# Altium schematic sheet PS_Board_p1.SchDoc: Блок питания модуля управления
size A4; Revision: Rev. A
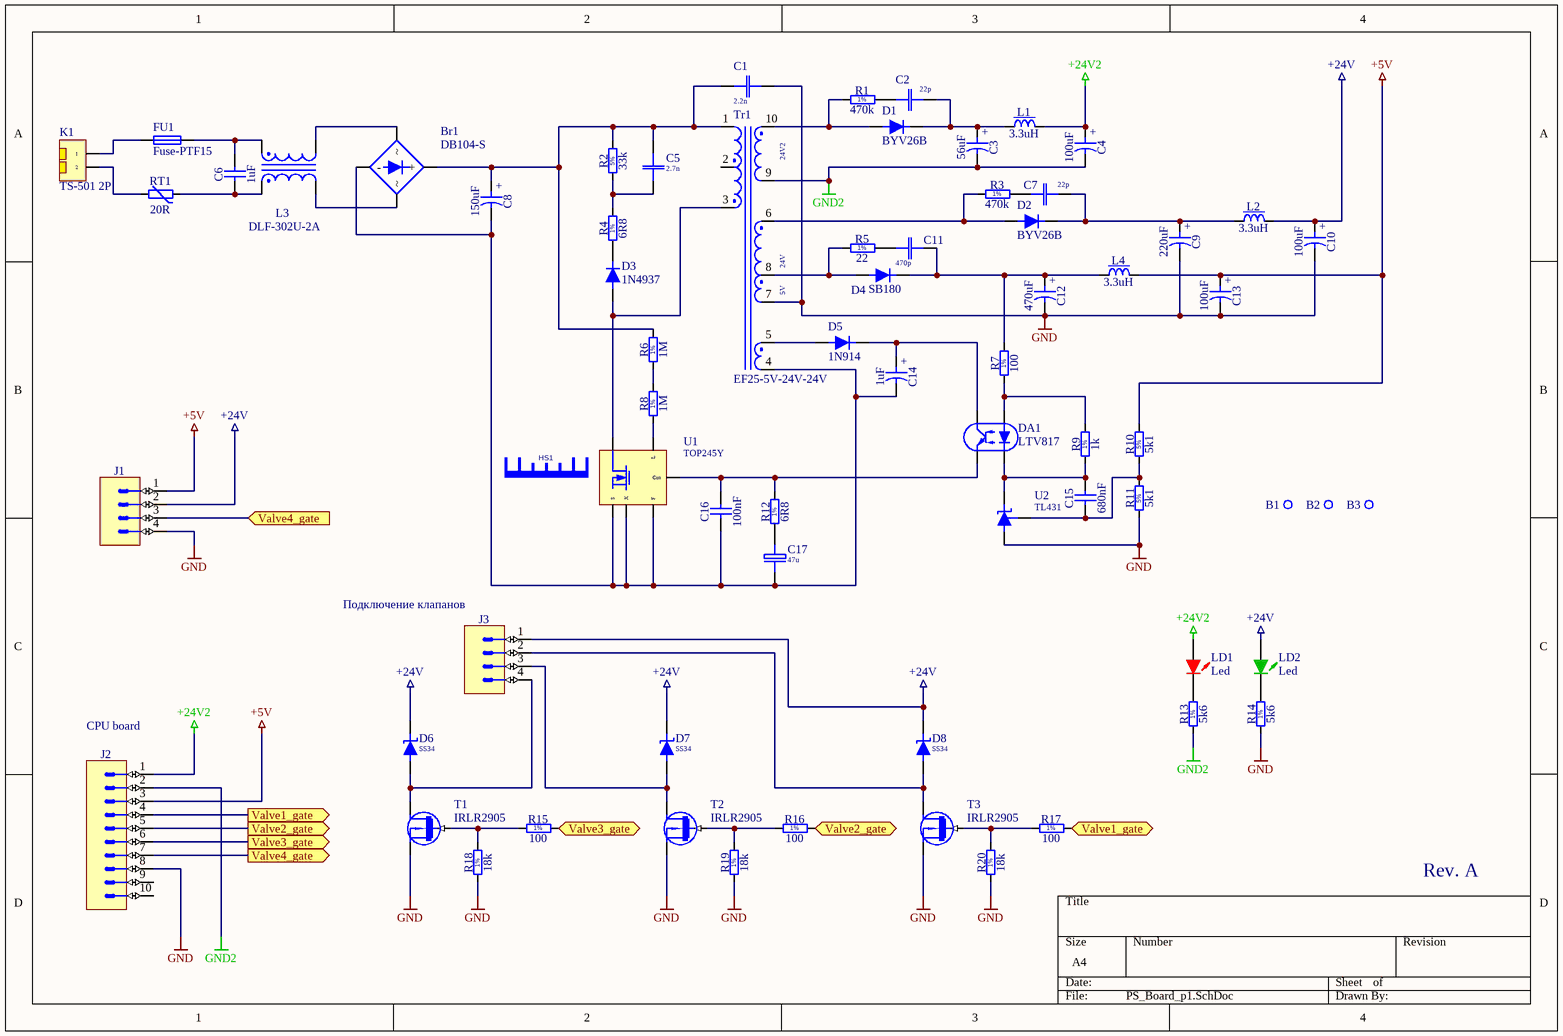
[diagram p0: PS_Board_p1.SchDoc]

## Parts
B1  Plated Hole  [MTG350_650]  (value not drawn)
B2  Plated Hole  [MTG350_650]  (value not drawn)
B3  Plated Hole  [MTG350_650]  (value not drawn)
Br1  DB104-S  [DB-S]
C1  2.2n  [C Y2 7.5b]
C2  22p  [Cap-Disk-D5.5-R5.08]
C3  56uF  [CAPPR500-1050X1150]
C4  100uF  [CAPPR350-850X800]
C5  2.7n  [C Y2 7.5b]
C6  1uF  [CAPR2750-1300X3150X2400]
C7  22p  [Cap-Disk-D5.5-R5.08]
C8  150uF  [CAPPR1000-2300X4200]
C9  220uF  [CAPPR350-850X1300]
C10  100uF  [CAPPR350-850X800]
C11  470p  [Cap-Disk-D5.5-R5.08]
C12  470uF  [CAPPR500-1050X2200]
C13  100uF  [CAPPR350-850X800]
C14  1uF  [CAPPRB254-450X710]
C15  680nF  [CAPC2012X135N]
C16  100nF  [CAPC2012X135N]
C17  47u  [El-d5-h11-F2.54]
D1  BYV26B  [SOD-64-300]
D2  BYV26B  [SOD-64-300]
D3  1N4937  [DO-41-300]
D4  SB180  [DO-41-300]
D5  1N914  [DO-35-300]
D6  SS34  [DO-214AB (SMC)]
D7  SS34  [DO-214AB (SMC)]
D8  SS34  [DO-214AB (SMC)]
DA1  LTV817  [DIL4-300a]
FU1  Fuse-PTF15  [FUSE-MCH]
HS1  Heat Sink No Pad  [HSINK_FISCHER_FK 242 SA 220 O_V]  (value not drawn)
J1  KK®  [MOLEX_22-27-2041]  (value not drawn)
J2  C-Grid®  [MOLEX_70246-1004]  (value not drawn)
J3  KK®  [MOLEX_22-27-2041]  (value not drawn)
K1  TS-501 2P  [TS-501 2P-2.5]
L1  3.3uH  [IND_WURTH_WE-TI]
L2  3.3uH  [IND_WURTH_WE-TI]
L3  DLF-302U-2A  [DLF-302U-2A]
L4  3.3uH  [IND_WURTH_WE-TI]
LD1  Led  [Led 0805-Red]
LD2  Led  [Led 0805-Green]
R1  470k  [RES1016-630X250]
R2  33k  [RES2286-1670X520]
R3  470k  [RES1016-630X250]
R4  6R8  [RES1016-630X250]
R5  22  [RES1016-630X250]
R6  1M  [RES1016-630X250]
R7  100  [RES1016-630X250]
R8  1M  [RES1016-630X250]
R9  1k  [RES1016-630X250]
R10  5k1  [RES_ARCOL_RCC025]
R11  5k1  [RES_ARCOL_RCC025]
R12  6R8  [RES1016-630X250]
R13  5k6  [RESC2012X60N]
R14  5k6  [RESC2012X60N]
R15  100  [RESC2012X60N]
R16  100  [RESC2012X60N]
R17  100  [RESC2012X60N]
R18  18k  [RESC2012X60N]
R19  18k  [RESC2012X60N]
R20  18k  [RESC2012X60N]
RT1  20R  [THERM_EPCOS_B57153S0]
T1  IRLR2905  [TO252AA]
T2  IRLR2905  [TO252AA]
T3  IRLR2905  [TO252AA]
Tr1  EF25-5V-24V-24V  [SP-EF25]
U1  TOP245Y  [TO220-7C]
U2  TL431  [TO92C]

## Ports
Valve1_gate (in), Valve1_gate (out), Valve2_gate (in), Valve2_gate (out), Valve3_gate (in), Valve3_gate (out), Valve4_gate (in), Valve4_gate (out)

## Nets
+5V: C13.1 J1.1 J2.3 L4.2 R10.2
+24V: C10.1 D6.2(K) D7.2(K) D8.2(K) J1.2 J3.1 L2.2 LD2.1(A)
+24V2: C4.1 J2.1 L1.2 LD1.1(A)
GND: C1.2 C9.2 C10.2 C12.2 C13.2 J1.4 J2.8 R11.1 R14.1 R18.1 R19.1 R20.1 T1.3(S) T2.3(S) T3.3(S) Tr1.7 U2.2(A)
GND2: C3.2 C4.2 J2.2 R13.1 Tr1.9
Valve1_gate: J2.4 R17.2 ; port Valve1_gate
Valve2_gate: J2.5 R16.2 ; port Valve2_gate
Valve3_gate: J2.6 R15.2 ; port Valve3_gate
Valve4_gate: J1.3 J2.7 ; port Valve4_gate
NetBr1_1: Br1.1(+) C1.1 C5.2 C8.1 R2.2 R6.2 Tr1.1
NetBr1_2: Br1.2(-) C8.2 C14.2 C16.1 C17.2 Tr1.4 U1.3(X) U1.4(S) U1.5(F)
NetBr1_3: Br1.3 L3.3
NetBr1_4: Br1.4 L3.4
NetC2_1: C2.1 R1.2
NetC2_2: C2.2 C3.1 D1.2(K) L1.1
NetC5_1: C5.1 R2.1 R4.2
NetC6_1: C6.1 L3.2 RT1.2
NetC6_2: C6.2 FU1.1 L3.1
NetC7_1: C7.1 R3.2
NetC7_2: C7.2 C9.1 D2.2(K) L2.1
NetC11_1: C11.1 R5.2
NetC11_2: C11.2 C12.1 D4.2(K) L4.1 R7.2
NetC14_1: C14.1 D5.2(C) DA1.4(C)
NetC15_1: C15.1 R10.1 R11.2 U2.3(Adj)
NetC15_2: C15.2 DA1.2(C) R9.1 U2.1(K)
NetC16_2: C16.2 DA1.3(E) R12.2 U1.1(Con)
NetC17_1: C17.1 R12.1
NetD1_1: D1.1(A) R1.1 Tr1.10
NetD2_1: D2.1(A) R3.1 Tr1.6
NetD3_1: D3.1(A) Tr1.3 U1.7(D)
NetD3_2: D3.2(K) R4.1
NetD4_1: D4.1(A) R5.1 Tr1.8
NetD5_1: D5.1(A) Tr1.5
NetD6_1: D6.1(A) J3.4 T1.2(D)
NetD7_1: D7.1(A) J3.3 T2.2(D)
NetD8_1: D8.1(A) J3.2 T3.2(D)
NetDA1_1: DA1.1(A) R7.1 R9.2
NetFU1_2: FU1.2 K1.1
NetK1_2: K1.2 RT1.1
NetLD1_2: LD1.2(K) R13.2
NetLD2_2: LD2.2(K) R14.2
NetR6_1: R6.1 R8.2
NetR8_1: R8.1 U1.2(L)
NetR15_1: R15.1 R18.2 T1.1(G)
NetR16_1: R16.1 R19.2 T2.1(G)
NetR17_1: R17.1 R20.2 T3.1(G)

Not connected (* = marked no-connect by the designer): B1 1; B2 1; B3 1; J2 9 10; Tr1 2

## Notes on the sheet
- (near J3) Подключение клапанов
- (near J2) CPU board
- Rev. A
- (in symbol CAER_56UF_25V_20%_500-1050X1150_LESR0R025) +
- (in symbol CAER_100UF_25V_20%_RUBYCON_25ML100M8X7) +
- (in symbol CAER_150UF_400V_20%_EPCOS_B43501A9157M000) +
- (in symbol CAER_220UF_25V_20%_RUBYCON_25YXF220M8X11.5) +
- (in symbol CAER_470UF_25V_20%_500-1050X2200_LESR0R062) +
- (in symbol CTEB_1UF_35V_10%_254-450X710) +
- (in symbol EF25-5V-24V-24V) 24V2; 24V; 5V
- (in symbol R0805_5K6_1%_0.125W_100PPM) 1%
- (in symbol R0805_18K_1%_0.125W_100PPM) 1%
- (in symbol R0805_100R_1%_0.125W_100PPM) 1%
- (in symbol RCF_5K1_5%_0.25W_+10-6PPM_ARCOL_RCC025) 5%
- (in symbol RMF_1K_1%_0.6W_50PPM_1016-630X250) 1%
- (in symbol RMF_1M_1%_0.6W_50PPM_1016-630X250) 1%
- (in symbol RMF_6R8_1%_0.6W_50PPM_1016-630X250) 1%
- (in symbol RMF_22R_1%_0.6W_50PPM_1016-630X250) 1%
- (in symbol RMF_33K_5%_3W_250PPM_2286-1670X520) 5%
- (in symbol RMF_100R_1%_0.6W_50PPM_1016-630X250) 1%
- (in symbol RMF_470K_1%_0.6W_50PPM_1016-630X250) 1%

## Library data of the parts
B1-B3 = PLATED_HOLE3.5_PAD6.5: Single Terminal Socket; Part Description: Plated Through Hole: Hole Dia.=3.5mm Pad Dia.=6.5mm; Mounted: No; Table: Pads; Part Number: PLATED_HOLE3.5_PAD6.5; Component Kind: Standard (No BOM); Component Type: Standard (No BOM); Pin Count: 1; Family: Plated Hole; Socket: No; SMD: No; Status: None; ComponentHeight: 0mm; Author: CERN DEM JLC; CreateDate: 20.11.2008; LatestRevisionDate: 23.11.2011; PackageDescription: Plated Through Hole: Hole Dia.=3.5mm Pad Dia.=6.5mm
Br1 = DB104-S: SMD 1A 400V; Price: 0.23
C1 C5 = Y2 1n 250V AC: Y2 250V AC Y5P; Tip: Ceramic  Disc Y2 1nF 250VAC Y5P; Price: 0.1
  C1: Value: 2.2n
  C5: Value: 2.7n
C2 C7 = Cer Disc HV 220p 1kV: 22p 1kV Y5P; Tip: Suntan TS16 220pF 1kV Y5P; Price: 0.072; Value: 22p
C3 = CAER_56UF_25V_20%_500-1050X1150_LESR0R025: Polarised capacitor; Part Description: Low ESR 0R025 Aluminum Solid Capacitor With Organic Semiconductive Electrolyte; Manufacturer: SANYO OS-CON; Manufacturer Part Number: 25SP56M; Voltage: 25V; Tolerance: ±20%; Table: Capacitors THD; Part Number: CAER_56UF_25V_20%_500-1050X1150_LESR0R025; Component Kind: Standard; Component Type: Standard; Pin Count: 2; Value: 56uF; Status: Preferred; Case: LS5 D10.5 x H11.5; Mounted: Yes; Socket: No; SMD: No; ComponentHeight: 11.5mm; HelpURL: \\cern.ch\dfs\Applications\Altium\Datasheets\CAER-LESR_SANYO_SP.pdf; Author: CERN DEM JLC; CreateDate: 29.01.2008; LatestRevisionDate: 16.03.2009
C4 C10 C13 = CAER_100UF_25V_20%_RUBYCON_25ML100M8X7: Polarised capacitor; Part Description: Aluminum Electrolytic Capacitor, (ML Series); Voltage: 25V; Tolerance: ±20%; Table: Capacitors THD; Part Number: CAER_100UF_25V_20%_RUBYCON_25ML100M8X7; Component Kind: Standard; Component Type: Standard; Pin Count: 2; Value: 100uF; Status: None; Manufacturer: RUBYCON; Manufacturer Part Number: 25ML100M8X7; Case: LS3.5 D8.5 x H8; Mounted: Yes; Socket: No; SMD: No; ComponentHeight: 8mm; HelpURL: \\cern.ch\dfs\Applications\Altium\Datasheets\CAER_RUBYCON_25ML100M8X7.pdf; Author: CERN DEM JMW; CreateDate: 17.11.2008; LatestRevisionDate: 08.05.2013
C6 = CPPR_1UF_275VAC_20%_2750-1300X3150X2400: Non-polarised capacitor; Part Description: Metallized Polypropylene RFI Capacitor Class X2 (MKP-X2); Manufacturer: WIMA; Manufacturer Part Number: MKX21W41006D00MSSD; Voltage: 275VAC; Tolerance: ±20%; Table: Capacitors THD; Part Number: CPPR_1UF_275VAC_20%_2750-1300X3150X2400; Component Kind: Standard; Component Type: Standard; Pin Count: 2; Value: 1uF; Status: None; Case: LS27.5 W13 x L31.5 x H24; Mounted: Yes; Socket: No; SMD: No; ComponentHeight: 24mm; HelpURL: \\cern.ch\dfs\Applications\Altium\Datasheets\CPPR_WIMA_MKP-X2.pdf; Author: CERN DEM JLC; CreateDate: 23.06.2008; LatestRevisionDate: 30.01.2012
C8 = CAER_150UF_400V_20%_EPCOS_B43501A9157M000: Polarised capacitor; Part Description: Aluminum Electrolytic Capacitor  (B43501 Series); Manufacturer: EPCOS; Voltage: 400V; Tolerance: ±20%; Table: Capacitors THD; Part Number: CAER_150UF_400V_20%_EPCOS_B43501A9157M000; Component Kind: Standard; Component Type: Standard; Pin Count: 2; Value: 150uF; Status: None; Manufacturer Part Number: B43501A9157M000; Case: LS10 D22 x H40; Mounted: Yes; Socket: No; SMD: No; ComponentHeight: 42mm; HelpURL: \\cern.ch\dfs\Applications\Altium\Datasheets\CAER_EPCOS_B43501.pdf; Author: CERN DEM JLC; CreateDate: 15.09.2011; LatestRevisionDate: 15.09.2011
C9 = CAER_220UF_25V_20%_RUBYCON_25YXF220M8X11.5: Polarised capacitor; Part Description: Radial Miniature, Aluminum Electrolytic Capacitor, (YXF Series); Voltage: 25V; Tolerance: ±20%; Table: Capacitors THD; Part Number: CAER_220UF_25V_20%_RUBYCON_25YXF220M8X11.5; Component Kind: Standard; Component Type: Standard; Pin Count: 2; Value: 220uF; Status: None; Manufacturer: RUBYCON; Manufacturer Part Number: 25YXF220M8X11.5; Case: LS3.5 D8.5 x H13; Mounted: Yes; Socket: No; SMD: No; ComponentHeight: 13mm; HelpURL: \\cern.ch\dfs\Applications\Altium\Datasheets\CAER_RUBYCON_YXF.pdf; Author: CERN DEM JLC; CreateDate: 20.08.2009; LatestRevisionDate: 17.09.2009
C11 = Cer Disc HV 220p 1kV: 470p 1kV Y5P; Tip: Suntan TS16 220pF 1kV Y5P; Price: 0.072; Value: 470p
C12 = CAER_470UF_25V_20%_500-1050X2200_LESR0R062: Polarised capacitor; Part Description: Low ESR 0R062 Aluminum Electrolytic Capacitor; Manufacturer: VISHAY BCCOMPONENTS; Manufacturer Part Number: MAL213666471E3 Series 136RVI; Voltage: 25V; Tolerance: ±20%; Table: Capacitors THD; Part Number: CAER_470UF_25V_20%_500-1050X2200_LESR0R062; Component Kind: Standard; Component Type: Standard; Pin Count: 2; Value: 470uF; Status: Preferred; Case: LS5 D10.5 x H22; Mounted: Yes; Socket: No; SMD: No; ComponentHeight: 22mm; HelpURL: \\cern.ch\dfs\Applications\Altium\Datasheets\CAER-LESR_VISHAY_136RVI.pdf; Author: CERN DEM JLC; CreateDate: 03.07.2008; LatestRevisionDate: 16.03.2009
C14 = CTEB_1UF_35V_10%_254-450X710: Polarised capacitor; Part Description: Solid Tantalum Resin Dipped Capacitor; Manufacturer: KEMET; Manufacturer Part Number: T350A105K035AT; Voltage: 35V; Tolerance: ±10%; Table: Capacitors THD; Part Number: CTEB_1UF_35V_10%_254-450X710; Component Kind: Standard; Component Type: Standard; Pin Count: 2; Value: 1uF; Status: None; Case: LS2.54 D4.5 x H7.1; Mounted: Yes; Socket: No; SMD: No; ComponentHeight: 7.1mm; HelpURL: \\cern.ch\dfs\Applications\Altium\Datasheets\CTEB_KEMET_T350.pdf; Author: CERN DEM JLC; CreateDate: 16.12.2009; LatestRevisionDate: 16.12.2009
C15 = CC0805_680NF_16V_10%_X7R: Non-polarised capacitor; Part Description: SMD Multilayer Chip Ceramic Capacitor; Manufacturer: GENERIC; Manufacturer1 Part Number: C0805C684K5RAC; Voltage: 16V; TC: X7R; Tolerance: ±10%; Table: Capacitors SMD; Part Number: CC0805_680NF_16V_10%_X7R; Component Kind: Standard; Component Type: Standard; Pin Count: 2; Value: 680nF; Status: Preferred; Manufacturer Part Number: CC0805_680NF_16V_10%_X7R; Case: 0805; Mounted: Yes; Socket: No; SMD: Yes; Manufacturer1 Example: KEMET; Manufacturer1 ComponentHeight: 1.4mm; HelpURL: \\cern.ch\dfs\Applications\Altium\Datasheets\CC0805_X7R_KEMET.pdf; Author: CERN DEM JLC; CreateDate: 03.12.2007; LatestRevisionDate: 03.12.2007
C16 = CC0805_100NF_50V_10%_X7R: Non-polarised capacitor; Part Description: SMD Multilayer Chip Ceramic Capacitor; Manufacturer: GENERIC; Manufacturer1 Part Number: B37941K5104K62; Voltage: 50V; TC: X7R; Tolerance: ±10%; Table: Capacitors SMD; Part Number: CC0805_100NF_50V_10%_X7R; Component Kind: Standard; Component Type: Standard; Pin Count: 2; Value: 100nF; Status: Preferred; Manufacturer Part Number: CC0805_100NF_50V_10%_X7R; Case: 0805; Mounted: Yes; Socket: No; SMD: Yes; Manufacturer1 Example: EPCOS; Manufacturer1 ComponentHeight: 1.35mm; HelpURL: \\cern.ch\dfs\Applications\Altium\Datasheets\CC0805_X7R_EPCOS.pdf; Author: CERN DEM JLC; CreateDate: 03.12.2007; LatestRevisionDate: 03.12.2007
C17 = 47u-25V-105: 25V-105; Price: 0.06; Value: 47u
D1 D2 = BYV27-100: 100V 2A 25nS; Price: 0.58
D3 = 1N4007: 1000V 1A; Price: 0.05
D4 = 1N4007: Price: 0.05
D5 = 1N4148: DO-35 75V 0.2A 1uS 4A 4nS; Price: 0.02
D6-D8 = SS34: SMD SMC  40V 3A; Price: 0.14
FU1 = Fuse-PTF15: 5mm 6.3A; Price: 1
HS1 = HSINK_FISCHER_FK 242 SA 220 O_v: Heat Sink Without Pad; Part Description: TO-220 Heat Sink  Rth: 26°C/W - Vertical Mount; Manufacturer: FISCHER ELEKTRONIK; Table: Heat-Sinks; Part Number: HSINK_FISCHER_FK 242 SA 220 O_v; Component Kind: Standard; Component Type: Standard; Pin Count: 0; PackageDescription: TO-220 Heat Sink  Rth: 26°C/W - Vertical Mount; Mounted: Yes; Socket: No; SMD: No; Status: None; Manufacturer Part Number: FK 242 SA 220 O; ComponentHeight: 15.24mm; HelpURL: \\cern.ch\dfs\Applications\Altium\Datasheets\HSINK_FISCHER_FK 242 SA 220 O.pdf; Author: CERN DEM JLC; CreateDate: 02.11.2009; LatestRevisionDate: 10.10.2011
J1 J3 = MOLEX_22-27-2041: Connector 4 Male; Part Description: 2.54mm (.100") Pitch KK® Wire-to-Board Header, Vertical, with Friction Lock, 4 Circuits, Tin (Sn) Plating; Manufacturer: MOLEX; Part Number: MOLEX_22-27-2041; Component Kind: Standard; Component Type: Standard; Pin Count: 4; Family: KK®; Mounted: Yes; Socket: No; SMD: No; Status: None; Manufacturer Part Number: 22-27-2041; ComponentHeight: 11.7mm; HelpURL: \\cern.ch\dfs\Applications\Altium\Datasheets\MOLEX_22-27-2041.pdf; Author: CERN DEM JLC; CreateDate: 04.12.2008; LatestRevisionDate: 04.12.2008; Table: MOLEX
J2 = MOLEX_70246-1004: Connector 10 Male; Part Description: 2.54mm Pitch C-Grid® Header, Low Profile, Dual Row, Vertical, Shrouded Header; Manufacturer: MOLEX; Part Number: MOLEX_70246-1004; Component Kind: Standard; Component Type: Standard; Pin Count: 10; Family: C-Grid®; Mounted: Yes; Socket: No; SMD: No; Status: None; Manufacturer Part Number: 70246-1004; ComponentHeight: 9.27mm; HelpURL: \\cern.ch\dfs\Applications\Altium\Datasheets\MOLEX_70246-1004.pdf; Author: CERN DEM JLC; CreateDate: 14.08.2013; LatestRevisionDate: 14.08.2013; Table: MOLEX
K1 = TS-501 2P: 10A/300V AC 5mm; Price: 0.27
L1 L2 L4 = IND_3.3UH_20%_WURTH_WE-TI: Inductor With Magnetic core; Part Description: Radial Leaded Filter Choke Serie WE-TI; Manufacturer: WURTH ELEKTRONIK; Manufacturer Part Number: 744772033; Power: 5A; Resistance: 0.013R; Tolerance: ±20%; Table: Inductors THD; Part Number: IND_3.3UH_20%_WURTH_WE-TI; Component Kind: Standard; Component Type: Standard; Pin Count: 2; Value: 3.3uH; Case: LS5.08 H10 x D8.3; Mounted: Yes; Socket: No; SMD: No; ComponentHeight: 10mm; HelpURL: \\cern.ch\dfs\Applications\Altium\Datasheets\IND_WURTH_WE-TI_744772033.pdf; Author: CERN DEM JLC; CreateDate: 11.11.2008; LatestRevisionDate: 09.04.2014
LD1 = Led 0805 KP-2012EC: Red  627nm 12mcd; Price: 0.09
LD2 = Led 0805 KP-2012SGC: Green 565nm 15mcd; Price: 0.09
R1 R3 = RMF_470K_1%_0.6W_50PPM_1016-630X250: Resistor - 1%; Part Description: Leaded Metal Film Resistor; Manufacturer: GENERIC; Manufacturer1 Part Number: MBB02070C4703FCT00; Power: 0.6W; TC: ±50ppm/°C; Table: Resistors THD; Part Number: RMF_470K_1%_0.6W_50PPM_1016-630X250; Component Kind: Standard; Component Type: Standard; Pin Count: 2; Value: 470k; Status: Preferred; Tolerance: ±1%; Manufacturer Part Number: RMF_470K_1%_0.6W_50PPM_1016-630X250; Case: LS10.16 L6.3 x D2.5; Mounted: Yes; Socket: No; SMD: No; ComponentHeight: 2.5mm; Manufacturer1 Example: VISHAY BEYSCHLAG; Manufacturer1 ComponentHeight: 2.5mm; HelpURL: \\cern.ch\dfs\Applications\Altium\Datasheets\RMF_VISHAY_MBB0207.pdf; Author: CERN DEM JLC; CreateDate: 04.12.2007; LatestRevisionDate: 07.04.2008
R2 = RMF_33K_5%_3W_250PPM_2286-1670X520: Resistor - 5%; Part Description: Leaded Power Metal Film Resistor; Manufacturer: GENERIC; Manufacturer1 Part Number: PR03000203302JAC00; Power: 3W; TC: ±250ppm/°C; Table: Resistors THD; Part Number: RMF_33K_5%_3W_250PPM_2286-1670X520; Component Kind: Standard; Component Type: Standard; Pin Count: 2; Value: 33k; Status: Preferred; Tolerance: ±5%; Manufacturer Part Number: RMF_33K_5%_3W_250PPM_2286-1670X520; Case: LS22.86 L16.7 x D5.2; Mounted: Yes; Socket: No; SMD: No; ComponentHeight: 5.2mm; Manufacturer1 Example: VISHAY BCCOMPONENT; Manufacturer1 ComponentHeight: 5.2mm; HelpURL: \\cern.ch\dfs\Applications\Altium\Datasheets\RMF_VISHAY_PR03.pdf; Author: CERN DEM JLC; CreateDate: 23.06.2008; LatestRevisionDate: 01.10.2012
R4 R12 = RMF_6R8_1%_0.6W_50PPM_1016-630X250: Resistor - 1%; Part Description: Leaded Metal Film Resistor; Manufacturer: GENERIC; Manufacturer1 Part Number: MBB02070C6808FCT00; Power: 0.6W; TC: ±50ppm/°C; Table: Resistors THD; Part Number: RMF_6R8_1%_0.6W_50PPM_1016-630X250; Component Kind: Standard; Component Type: Standard; Pin Count: 2; Value: 6R8; Status: Not recommended; Tolerance: ±1%; Manufacturer Part Number: RMF_6R8_1%_0.6W_50PPM_1016-630X250; Case: LS10.16 L6.3 x D2.5; Mounted: Yes; Socket: No; SMD: No; ComponentHeight: 2.5mm; Manufacturer1 Example: VISHAY BEYSCHLAG; Manufacturer1 ComponentHeight: 2.5mm; HelpURL: \\cern.ch\dfs\Applications\Altium\Datasheets\RMF_VISHAY_MBB0207.pdf; Author: CERN DEM JLC; CreateDate: 04.12.2007; LatestRevisionDate: 07.04.2008
R5 = RMF_22R_1%_0.6W_50PPM_1016-630X250: Resistor - 1%; Part Description: Leaded Metal Film Resistor; Manufacturer: GENERIC; Manufacturer1 Part Number: MBB02070C2209FCT00; Power: 0.6W; TC: ±50ppm/°C; Table: Resistors THD; Part Number: RMF_22R_1%_0.6W_50PPM_1016-630X250; Component Kind: Standard; Component Type: Standard; Pin Count: 2; Value: 22; Status: Preferred; Tolerance: ±1%; Manufacturer Part Number: RMF_22R_1%_0.6W_50PPM_1016-630X250; Case: LS10.16 L6.3 x D2.5; Mounted: Yes; Socket: No; SMD: No; ComponentHeight: 2.5mm; Manufacturer1 Example: VISHAY BEYSCHLAG; Manufacturer1 ComponentHeight: 2.5mm; HelpURL: \\cern.ch\dfs\Applications\Altium\Datasheets\RMF_VISHAY_MBB0207.pdf; Author: CERN DEM JLC; CreateDate: 04.12.2007; LatestRevisionDate: 07.04.2008
R6 R8 = RMF_1M_1%_0.6W_50PPM_1016-630X250: Resistor - 1%; Part Description: Leaded Metal Film Resistor; Manufacturer: GENERIC; Manufacturer1 Part Number: MBB02070C1004FCT00; Power: 0.6W; TC: ±50ppm/°C; Table: Resistors THD; Part Number: RMF_1M_1%_0.6W_50PPM_1016-630X250; Component Kind: Standard; Component Type: Standard; Pin Count: 2; Value: 1M; Status: Preferred; Tolerance: ±1%; Manufacturer Part Number: RMF_1M_1%_0.6W_50PPM_1016-630X250; Case: LS10.16 L6.3 x D2.5; Mounted: Yes; Socket: No; SMD: No; ComponentHeight: 2.5mm; Manufacturer1 Example: VISHAY BEYSCHLAG; Manufacturer1 ComponentHeight: 2.5mm; HelpURL: \\cern.ch\dfs\Applications\Altium\Datasheets\RMF_VISHAY_MBB0207.pdf; Author: CERN DEM JLC; CreateDate: 04.12.2007; LatestRevisionDate: 07.04.2008
R7 = RMF_100R_1%_0.6W_50PPM_1016-630X250: Resistor - 1%; Part Description: Leaded Metal Film Resistor; Manufacturer: GENERIC; Manufacturer1 Part Number: MBB02070C1100FCT00; Power: 0.6W; TC: ±50ppm/°C; Table: Resistors THD; Part Number: RMF_100R_1%_0.6W_50PPM_1016-630X250; Component Kind: Standard; Component Type: Standard; Pin Count: 2; Value: 100; Status: Preferred; Tolerance: ±1%; Manufacturer Part Number: RMF_100R_1%_0.6W_50PPM_1016-630X250; Case: LS10.16 L6.3 x D2.5; Mounted: Yes; Socket: No; SMD: No; ComponentHeight: 2.5mm; Manufacturer1 Example: VISHAY BEYSCHLAG; Manufacturer1 ComponentHeight: 2.5mm; HelpURL: \\cern.ch\dfs\Applications\Altium\Datasheets\RMF_VISHAY_MBB0207.pdf; Author: CERN DEM JLC; CreateDate: 04.12.2007; LatestRevisionDate: 07.04.2008
R9 = RMF_1K_1%_0.6W_50PPM_1016-630X250: Resistor - 1%; Part Description: Leaded Metal Film Resistor; Manufacturer: GENERIC; Manufacturer1 Part Number: MBB02070C1001FCT00; Power: 0.6W; TC: ±50ppm/°C; Table: Resistors THD; Part Number: RMF_1K_1%_0.6W_50PPM_1016-630X250; Component Kind: Standard; Component Type: Standard; Pin Count: 2; Value: 1k; Status: Preferred; Tolerance: ±1%; Manufacturer Part Number: RMF_1K_1%_0.6W_50PPM_1016-630X250; Case: LS10.16 L6.3 x D2.5; Mounted: Yes; Socket: No; SMD: No; ComponentHeight: 2.5mm; Manufacturer1 Example: VISHAY BEYSCHLAG; Manufacturer1 ComponentHeight: 2.5mm; HelpURL: \\cern.ch\dfs\Applications\Altium\Datasheets\RMF_VISHAY_MBB0207.pdf; Author: CERN DEM JLC; CreateDate: 04.12.2007; LatestRevisionDate: 07.04.2008
R10 R11 = RCF_5K1_5%_0.25W_+10-6PPM_ARCOL_RCC025: Resistor - 5%; Part Description: Solid Carbon Resistor RCC Series; Manufacturer: ARCOL; Manufacturer Part Number: RCC025 5k1 J; Power: 0.25W; TC: +10-6ppm/°C; Table: Resistors THD; Part Number: RCF_5K1_5%_0.25W_+10-6PPM_ARCOL_RCC025; Component Kind: Standard; Component Type: Standard; Pin Count: 2; Value: 5k1; Status: None; Tolerance: ±5%; Case: LS10.16 L6.3 x D2.4; Mounted: Yes; Socket: No; SMD: No; ComponentHeight: 2.5mm; HelpURL: \\cern.ch\dfs\Applications\Altium\Datasheets\RCF_ARCOL_RCC025.pdf; Author: CERN DEM JLC; CreateDate: 30.10.2013; LatestRevisionDate: 30.10.2013
R13 R14 = R0805_5K6_1%_0.125W_100PPM: Resistor - 1%; Part Description: General Purpose Thick Film Chip Resistor; Manufacturer: GENERIC; Manufacturer1 Part Number: NRC10F5601TRF; Power: 0.125W; TC: ±100ppm/°C; Table: Resistors SMD; Part Number: R0805_5K6_1%_0.125W_100PPM; Component Kind: Standard; Component Type: Standard; Pin Count: 2; Value: 5k6; Status: Preferred; Tolerance: ±1%; Manufacturer Part Number: R0805_5K6_1%_0.125W_100PPM; Case: 0805; Mounted: Yes; Socket: No; SMD: Yes; Manufacturer1 Example: NIC COMPONENT; Manufacturer1 ComponentHeight: 0.6mm; HelpURL: \\cern.ch\dfs\Applications\Altium\Datasheets\R0805_NIC_NRC.pdf; Author: CERN DEM JLC; CreateDate: 03.12.2007; LatestRevisionDate: 13.03.2008
R15-R17 = R0805_100R_1%_0.125W_100PPM: Resistor - 1%; Part Description: General Purpose Thick Film Chip Resistor; Manufacturer: GENERIC; Manufacturer1 Part Number: NRC10F4700TRF; Power: 0.125W; TC: ±100ppm/°C; Table: Resistors SMD; Part Number: R0805_100R_1%_0.125W_100PPM; Component Kind: Standard; Component Type: Standard; Pin Count: 2; Value: 100; Status: Preferred; Tolerance: ±1%; Manufacturer Part Number: R0805_100R_1%_0.125W_100PPM; Case: 0805; Mounted: Yes; Socket: No; SMD: Yes; Manufacturer1 Example: NIC COMPONENT; Manufacturer1 ComponentHeight: 0.6mm; HelpURL: \\cern.ch\dfs\Applications\Altium\Datasheets\R0805_NIC_NRC.pdf; Author: CERN DEM JLC; CreateDate: 03.12.2007; LatestRevisionDate: 13.03.2008
R18-R20 = R0805_18K_1%_0.125W_100PPM: Resistor - 1%; Part Description: General Purpose Thick Film Chip Resistor; Manufacturer: GENERIC; Manufacturer1 Part Number: NRC10F1802TRF; Power: 0.125W; TC: ±100ppm/°C; Table: Resistors SMD; Part Number: R0805_18K_1%_0.125W_100PPM; Component Kind: Standard; Component Type: Standard; Pin Count: 2; Value: 18k; Status: Preferred; Tolerance: ±1%; Manufacturer Part Number: R0805_18K_1%_0.125W_100PPM; Case: 0805; Mounted: Yes; Socket: No; SMD: Yes; Manufacturer1 Example: NIC COMPONENT; Manufacturer1 ComponentHeight: 0.6mm; HelpURL: \\cern.ch\dfs\Applications\Altium\Datasheets\R0805_NIC_NRC.pdf; Author: CERN DEM JLC; CreateDate: 03.12.2007; LatestRevisionDate: 13.03.2008
RT1 = THERM_NTC_20R_EPCOS_B57153S0200M000: Thermistor NTC (Negative Temperature Coefficient); Part Description: Radial Leaded NTC Thermistor For Inrush Current Limiting; Manufacturer: EPCOS; Power: 1.6A; Voltage: 265VAC; Tolerance: ±20%; Table: Thermistors And Varistors; Part Number: THERM_NTC_20R_EPCOS_B57153S0200M000; Component Kind: Standard; Component Type: Standard; Pin Count: 2; Value: 20R; Status: None; Manufacturer Part Number: B57153S0200M000; Mounted: Yes; Socket: No; SMD: No; ComponentHeight: 13mm; HelpURL: \\cern.ch\dfs\Applications\Altium\Datasheets\THERM_EPCOS_B57153S0.pdf; Author: CERN DEM JLC; CreateDate: 23.04.2012; LatestRevisionDate: 23.04.2012
T1-T3 = IRLR2905: 55V 27moM 42A; price: 2
U1 = TOP244Y: 45W 1.35A 132kHz; Price: 6
DA1 = LTV817: Price: 0.28
U2 = TL431: Price: 0.24